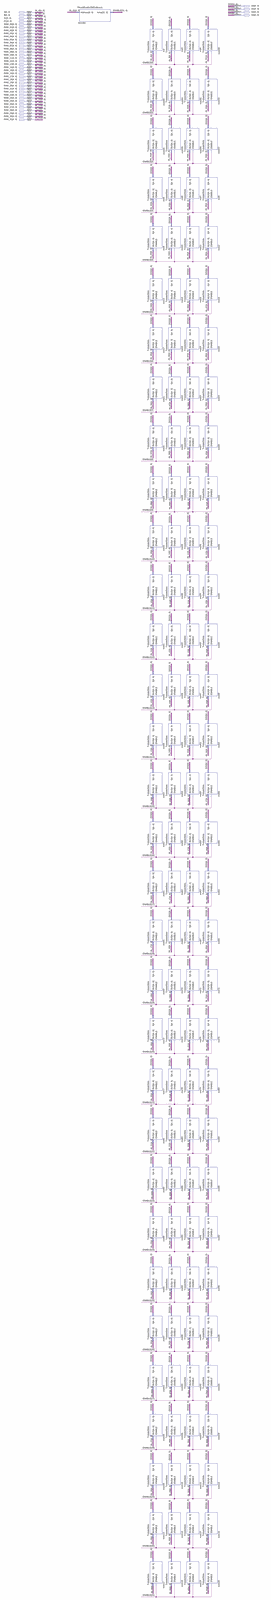
[diagram p0: schematic sheet, whole]
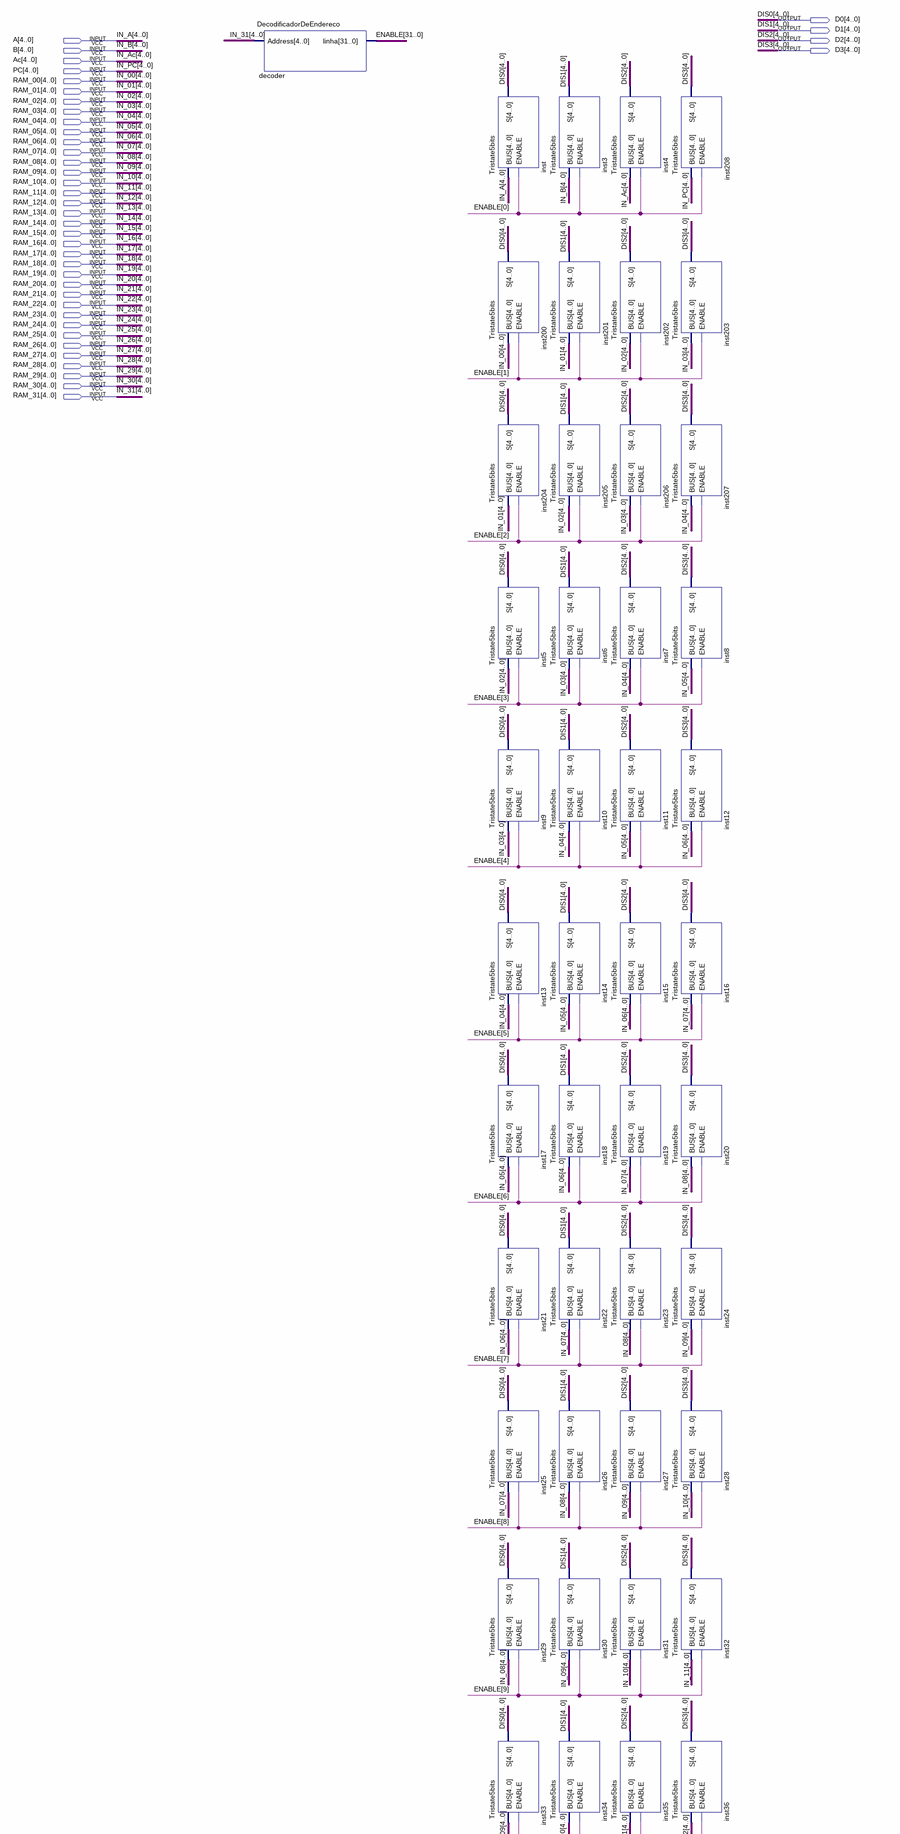
[diagram p1: schematic sheet, upper part]
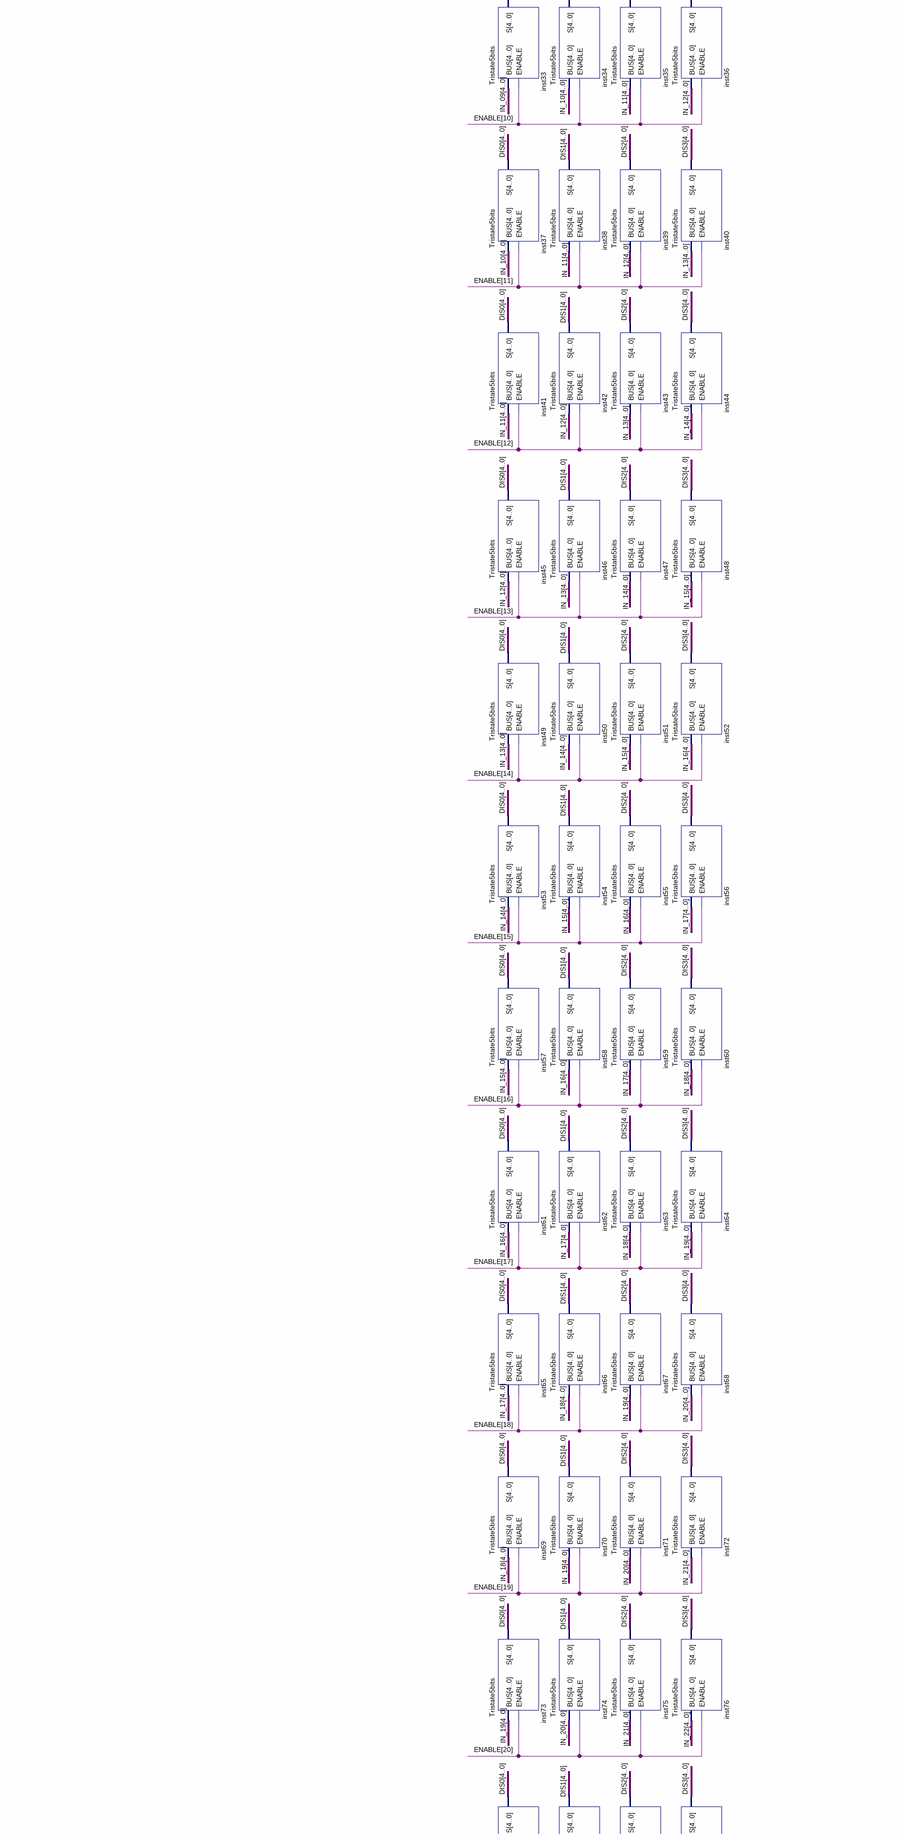
[diagram p2: schematic sheet, middle part]
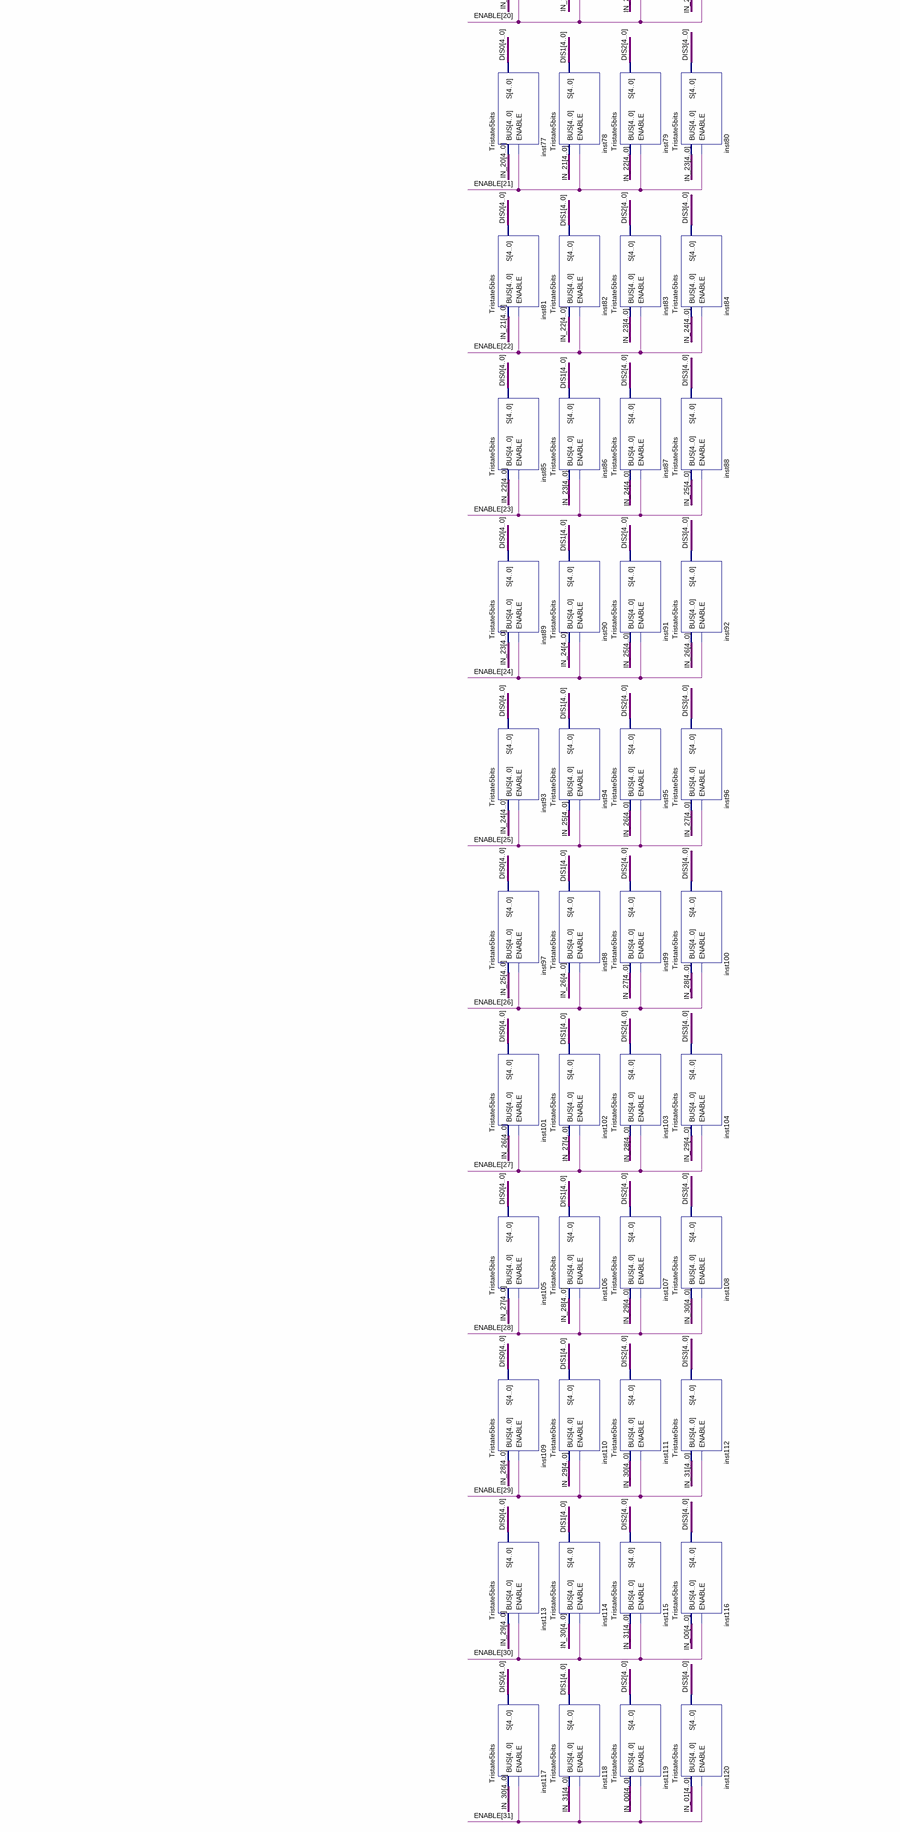
[diagram p3: schematic sheet, lower part]
// Quartus schematic Displays.bdf as structural Verilog: 129 symbols, 40 pins
module Displays (
  input  [4:0] A,
  input  [4:0] B,
  input  [4:0] Ac,
  input  [4:0] PC,
  input  [4:0] RAM_00,
  input  [4:0] RAM_01,
  input  [4:0] RAM_02,
  input  [4:0] RAM_03,
  input  [4:0] RAM_04,
  input  [4:0] RAM_05,
  input  [4:0] RAM_06,
  input  [4:0] RAM_07,
  input  [4:0] RAM_08,
  input  [4:0] RAM_09,
  input  [4:0] RAM_10,
  input  [4:0] RAM_11,
  input  [4:0] RAM_12,
  input  [4:0] RAM_13,
  input  [4:0] RAM_14,
  input  [4:0] RAM_15,
  input  [4:0] RAM_16,
  input  [4:0] RAM_17,
  input  [4:0] RAM_18,
  input  [4:0] RAM_19,
  input  [4:0] RAM_20,
  input  [4:0] RAM_21,
  input  [4:0] RAM_22,
  input  [4:0] RAM_23,
  input  [4:0] RAM_24,
  input  [4:0] RAM_25,
  input  [4:0] RAM_26,
  input  [4:0] RAM_27,
  input  [4:0] RAM_28,
  input  [4:0] RAM_29,
  input  [4:0] RAM_30,
  input  [4:0] RAM_31,
  output [4:0] D0,
  output [4:0] D1,
  output [4:0] D2,
  output [4:0] D3
);

  wire [31:0] ENABLE;

  DecodificadorDeEndereco decoder (.Address(RAM_31), .linha(ENABLE));
  Tristate5bits inst (.BUS(A), .ENABLE(ENABLE[0]), .S(D0));
  Tristate5bits inst200 (.BUS(RAM_00), .ENABLE(ENABLE[1]), .S(D0));
  Tristate5bits inst204 (.BUS(RAM_01), .ENABLE(ENABLE[2]), .S(D0));
  Tristate5bits inst5 (.BUS(RAM_02), .ENABLE(ENABLE[3]), .S(D0));
  Tristate5bits inst9 (.BUS(RAM_03), .ENABLE(ENABLE[4]), .S(D0));
  Tristate5bits inst13 (.BUS(RAM_04), .ENABLE(ENABLE[5]), .S(D0));
  Tristate5bits inst17 (.BUS(RAM_05), .ENABLE(ENABLE[6]), .S(D0));
  Tristate5bits inst21 (.BUS(RAM_06), .ENABLE(ENABLE[7]), .S(D0));
  Tristate5bits inst25 (.BUS(RAM_07), .ENABLE(ENABLE[8]), .S(D0));
  Tristate5bits inst29 (.BUS(RAM_08), .ENABLE(ENABLE[9]), .S(D0));
  Tristate5bits inst33 (.BUS(RAM_09), .ENABLE(ENABLE[10]), .S(D0));
  Tristate5bits inst37 (.BUS(RAM_10), .ENABLE(ENABLE[11]), .S(D0));
  Tristate5bits inst41 (.BUS(RAM_11), .ENABLE(ENABLE[12]), .S(D0));
  Tristate5bits inst45 (.BUS(RAM_12), .ENABLE(ENABLE[13]), .S(D0));
  Tristate5bits inst49 (.BUS(RAM_13), .ENABLE(ENABLE[14]), .S(D0));
  Tristate5bits inst53 (.BUS(RAM_14), .ENABLE(ENABLE[15]), .S(D0));
  Tristate5bits inst57 (.BUS(RAM_15), .ENABLE(ENABLE[16]), .S(D0));
  Tristate5bits inst61 (.BUS(RAM_16), .ENABLE(ENABLE[17]), .S(D0));
  Tristate5bits inst65 (.BUS(RAM_17), .ENABLE(ENABLE[18]), .S(D0));
  Tristate5bits inst69 (.BUS(RAM_18), .ENABLE(ENABLE[19]), .S(D0));
  Tristate5bits inst73 (.BUS(RAM_19), .ENABLE(ENABLE[20]), .S(D0));
  Tristate5bits inst77 (.BUS(RAM_20), .ENABLE(ENABLE[21]), .S(D0));
  Tristate5bits inst81 (.BUS(RAM_21), .ENABLE(ENABLE[22]), .S(D0));
  Tristate5bits inst85 (.BUS(RAM_22), .ENABLE(ENABLE[23]), .S(D0));
  Tristate5bits inst89 (.BUS(RAM_23), .ENABLE(ENABLE[24]), .S(D0));
  Tristate5bits inst93 (.BUS(RAM_24), .ENABLE(ENABLE[25]), .S(D0));
  Tristate5bits inst97 (.BUS(RAM_25), .ENABLE(ENABLE[26]), .S(D0));
  Tristate5bits inst101 (.BUS(RAM_26), .ENABLE(ENABLE[27]), .S(D0));
  Tristate5bits inst105 (.BUS(RAM_27), .ENABLE(ENABLE[28]), .S(D0));
  Tristate5bits inst109 (.BUS(RAM_28), .ENABLE(ENABLE[29]), .S(D0));
  Tristate5bits inst113 (.BUS(RAM_29), .ENABLE(ENABLE[30]), .S(D0));
  Tristate5bits inst117 (.BUS(RAM_30), .ENABLE(ENABLE[31]), .S(D0));
  Tristate5bits inst3 (.BUS(B), .ENABLE(ENABLE[0]), .S(D1));
  Tristate5bits inst201 (.BUS(RAM_01), .ENABLE(ENABLE[1]), .S(D1));
  Tristate5bits inst205 (.BUS(RAM_02), .ENABLE(ENABLE[2]), .S(D1));
  Tristate5bits inst6 (.BUS(RAM_03), .ENABLE(ENABLE[3]), .S(D1));
  Tristate5bits inst10 (.BUS(RAM_04), .ENABLE(ENABLE[4]), .S(D1));
  Tristate5bits inst14 (.BUS(RAM_05), .ENABLE(ENABLE[5]), .S(D1));
  Tristate5bits inst18 (.BUS(RAM_06), .ENABLE(ENABLE[6]), .S(D1));
  Tristate5bits inst22 (.BUS(RAM_07), .ENABLE(ENABLE[7]), .S(D1));
  Tristate5bits inst26 (.BUS(RAM_08), .ENABLE(ENABLE[8]), .S(D1));
  Tristate5bits inst30 (.BUS(RAM_09), .ENABLE(ENABLE[9]), .S(D1));
  Tristate5bits inst34 (.BUS(RAM_10), .ENABLE(ENABLE[10]), .S(D1));
  Tristate5bits inst38 (.BUS(RAM_11), .ENABLE(ENABLE[11]), .S(D1));
  Tristate5bits inst42 (.BUS(RAM_12), .ENABLE(ENABLE[12]), .S(D1));
  Tristate5bits inst46 (.BUS(RAM_13), .ENABLE(ENABLE[13]), .S(D1));
  Tristate5bits inst50 (.BUS(RAM_14), .ENABLE(ENABLE[14]), .S(D1));
  Tristate5bits inst54 (.BUS(RAM_15), .ENABLE(ENABLE[15]), .S(D1));
  Tristate5bits inst58 (.BUS(RAM_16), .ENABLE(ENABLE[16]), .S(D1));
  Tristate5bits inst62 (.BUS(RAM_17), .ENABLE(ENABLE[17]), .S(D1));
  Tristate5bits inst66 (.BUS(RAM_18), .ENABLE(ENABLE[18]), .S(D1));
  Tristate5bits inst70 (.BUS(RAM_19), .ENABLE(ENABLE[19]), .S(D1));
  Tristate5bits inst74 (.BUS(RAM_20), .ENABLE(ENABLE[20]), .S(D1));
  Tristate5bits inst78 (.BUS(RAM_21), .ENABLE(ENABLE[21]), .S(D1));
  Tristate5bits inst82 (.BUS(RAM_22), .ENABLE(ENABLE[22]), .S(D1));
  Tristate5bits inst86 (.BUS(RAM_23), .ENABLE(ENABLE[23]), .S(D1));
  Tristate5bits inst90 (.BUS(RAM_24), .ENABLE(ENABLE[24]), .S(D1));
  Tristate5bits inst94 (.BUS(RAM_25), .ENABLE(ENABLE[25]), .S(D1));
  Tristate5bits inst98 (.BUS(RAM_26), .ENABLE(ENABLE[26]), .S(D1));
  Tristate5bits inst102 (.BUS(RAM_27), .ENABLE(ENABLE[27]), .S(D1));
  Tristate5bits inst106 (.BUS(RAM_28), .ENABLE(ENABLE[28]), .S(D1));
  Tristate5bits inst110 (.BUS(RAM_29), .ENABLE(ENABLE[29]), .S(D1));
  Tristate5bits inst114 (.BUS(RAM_30), .ENABLE(ENABLE[30]), .S(D1));
  Tristate5bits inst118 (.BUS(RAM_31), .ENABLE(ENABLE[31]), .S(D1));
  Tristate5bits inst4 (.BUS(Ac), .ENABLE(ENABLE[0]), .S(D2));
  Tristate5bits inst202 (.BUS(RAM_02), .ENABLE(ENABLE[1]), .S(D2));
  Tristate5bits inst206 (.BUS(RAM_03), .ENABLE(ENABLE[2]), .S(D2));
  Tristate5bits inst7 (.BUS(RAM_04), .ENABLE(ENABLE[3]), .S(D2));
  Tristate5bits inst11 (.BUS(RAM_05), .ENABLE(ENABLE[4]), .S(D2));
  Tristate5bits inst15 (.BUS(RAM_06), .ENABLE(ENABLE[5]), .S(D2));
  Tristate5bits inst19 (.BUS(RAM_07), .ENABLE(ENABLE[6]), .S(D2));
  Tristate5bits inst23 (.BUS(RAM_08), .ENABLE(ENABLE[7]), .S(D2));
  Tristate5bits inst27 (.BUS(RAM_09), .ENABLE(ENABLE[8]), .S(D2));
  Tristate5bits inst31 (.BUS(RAM_10), .ENABLE(ENABLE[9]), .S(D2));
  Tristate5bits inst35 (.BUS(RAM_11), .ENABLE(ENABLE[10]), .S(D2));
  Tristate5bits inst39 (.BUS(RAM_12), .ENABLE(ENABLE[11]), .S(D2));
  Tristate5bits inst43 (.BUS(RAM_13), .ENABLE(ENABLE[12]), .S(D2));
  Tristate5bits inst47 (.BUS(RAM_14), .ENABLE(ENABLE[13]), .S(D2));
  Tristate5bits inst51 (.BUS(RAM_15), .ENABLE(ENABLE[14]), .S(D2));
  Tristate5bits inst55 (.BUS(RAM_16), .ENABLE(ENABLE[15]), .S(D2));
  Tristate5bits inst59 (.BUS(RAM_17), .ENABLE(ENABLE[16]), .S(D2));
  Tristate5bits inst63 (.BUS(RAM_18), .ENABLE(ENABLE[17]), .S(D2));
  Tristate5bits inst67 (.BUS(RAM_19), .ENABLE(ENABLE[18]), .S(D2));
  Tristate5bits inst71 (.BUS(RAM_20), .ENABLE(ENABLE[19]), .S(D2));
  Tristate5bits inst75 (.BUS(RAM_21), .ENABLE(ENABLE[20]), .S(D2));
  Tristate5bits inst79 (.BUS(RAM_22), .ENABLE(ENABLE[21]), .S(D2));
  Tristate5bits inst83 (.BUS(RAM_23), .ENABLE(ENABLE[22]), .S(D2));
  Tristate5bits inst87 (.BUS(RAM_24), .ENABLE(ENABLE[23]), .S(D2));
  Tristate5bits inst91 (.BUS(RAM_25), .ENABLE(ENABLE[24]), .S(D2));
  Tristate5bits inst95 (.BUS(RAM_26), .ENABLE(ENABLE[25]), .S(D2));
  Tristate5bits inst99 (.BUS(RAM_27), .ENABLE(ENABLE[26]), .S(D2));
  Tristate5bits inst103 (.BUS(RAM_28), .ENABLE(ENABLE[27]), .S(D2));
  Tristate5bits inst107 (.BUS(RAM_29), .ENABLE(ENABLE[28]), .S(D2));
  Tristate5bits inst111 (.BUS(RAM_30), .ENABLE(ENABLE[29]), .S(D2));
  Tristate5bits inst115 (.BUS(RAM_31), .ENABLE(ENABLE[30]), .S(D2));
  Tristate5bits inst119 (.BUS(RAM_00), .ENABLE(ENABLE[31]), .S(D2));
  Tristate5bits inst208 (.BUS(PC), .ENABLE(ENABLE[0]), .S(D3));
  Tristate5bits inst203 (.BUS(RAM_03), .ENABLE(ENABLE[1]), .S(D3));
  Tristate5bits inst207 (.BUS(RAM_04), .ENABLE(ENABLE[2]), .S(D3));
  Tristate5bits inst8 (.BUS(RAM_05), .ENABLE(ENABLE[3]), .S(D3));
  Tristate5bits inst12 (.BUS(RAM_06), .ENABLE(ENABLE[4]), .S(D3));
  Tristate5bits inst16 (.BUS(RAM_07), .ENABLE(ENABLE[5]), .S(D3));
  Tristate5bits inst20 (.BUS(RAM_08), .ENABLE(ENABLE[6]), .S(D3));
  Tristate5bits inst24 (.BUS(RAM_09), .ENABLE(ENABLE[7]), .S(D3));
  Tristate5bits inst28 (.BUS(RAM_10), .ENABLE(ENABLE[8]), .S(D3));
  Tristate5bits inst32 (.BUS(RAM_11), .ENABLE(ENABLE[9]), .S(D3));
  Tristate5bits inst36 (.BUS(RAM_12), .ENABLE(ENABLE[10]), .S(D3));
  Tristate5bits inst40 (.BUS(RAM_13), .ENABLE(ENABLE[11]), .S(D3));
  Tristate5bits inst44 (.BUS(RAM_14), .ENABLE(ENABLE[12]), .S(D3));
  Tristate5bits inst48 (.BUS(RAM_15), .ENABLE(ENABLE[13]), .S(D3));
  Tristate5bits inst52 (.BUS(RAM_16), .ENABLE(ENABLE[14]), .S(D3));
  Tristate5bits inst56 (.BUS(RAM_17), .ENABLE(ENABLE[15]), .S(D3));
  Tristate5bits inst60 (.BUS(RAM_18), .ENABLE(ENABLE[16]), .S(D3));
  Tristate5bits inst64 (.BUS(RAM_19), .ENABLE(ENABLE[17]), .S(D3));
  Tristate5bits inst68 (.BUS(RAM_20), .ENABLE(ENABLE[18]), .S(D3));
  Tristate5bits inst72 (.BUS(RAM_21), .ENABLE(ENABLE[19]), .S(D3));
  Tristate5bits inst76 (.BUS(RAM_22), .ENABLE(ENABLE[20]), .S(D3));
  Tristate5bits inst80 (.BUS(RAM_23), .ENABLE(ENABLE[21]), .S(D3));
  Tristate5bits inst84 (.BUS(RAM_24), .ENABLE(ENABLE[22]), .S(D3));
  Tristate5bits inst88 (.BUS(RAM_25), .ENABLE(ENABLE[23]), .S(D3));
  Tristate5bits inst92 (.BUS(RAM_26), .ENABLE(ENABLE[24]), .S(D3));
  Tristate5bits inst96 (.BUS(RAM_27), .ENABLE(ENABLE[25]), .S(D3));
  Tristate5bits inst100 (.BUS(RAM_28), .ENABLE(ENABLE[26]), .S(D3));
  Tristate5bits inst104 (.BUS(RAM_29), .ENABLE(ENABLE[27]), .S(D3));
  Tristate5bits inst108 (.BUS(RAM_30), .ENABLE(ENABLE[28]), .S(D3));
  Tristate5bits inst112 (.BUS(RAM_31), .ENABLE(ENABLE[29]), .S(D3));
  Tristate5bits inst116 (.BUS(RAM_00), .ENABLE(ENABLE[30]), .S(D3));
  Tristate5bits inst120 (.BUS(RAM_01), .ENABLE(ENABLE[31]), .S(D3));

  // Other names for the same wires on the sheet: DIS0[4:0] = D0; DIS1[4:0] = D1; DIS2[4:0] = D2; DIS3[4:0] = D3;
  //   IN_00[4:0] = RAM_00; IN_01[4:0] = RAM_01; IN_02[4:0] = RAM_02; IN_03[4:0] = RAM_03; IN_04[4:0] = RAM_04;
  //   IN_05[4:0] = RAM_05; IN_06[4:0] = RAM_06; IN_07[4:0] = RAM_07; IN_08[4:0] = RAM_08; IN_09[4:0] = RAM_09;
  //   IN_10[4:0] = RAM_10; IN_11[4:0] = RAM_11; IN_12[4:0] = RAM_12; IN_13[4:0] = RAM_13; IN_14[4:0] = RAM_14;
  //   IN_15[4:0] = RAM_15; IN_16[4:0] = RAM_16; IN_17[4:0] = RAM_17; IN_18[4:0] = RAM_18; IN_19[4:0] = RAM_19;
  //   IN_20[4:0] = RAM_20; IN_21[4:0] = RAM_21; IN_22[4:0] = RAM_22; IN_23[4:0] = RAM_23; IN_24[4:0] = RAM_24;
  //   IN_25[4:0] = RAM_25; IN_26[4:0] = RAM_26; IN_27[4:0] = RAM_27; IN_28[4:0] = RAM_28; IN_29[4:0] = RAM_29;
  //   IN_30[4:0] = RAM_30; IN_31[4:0] = RAM_31; IN_A[4:0] = A; IN_Ac[4:0] = Ac; IN_B[4:0] = B; IN_PC[4:0] = PC
endmodule
